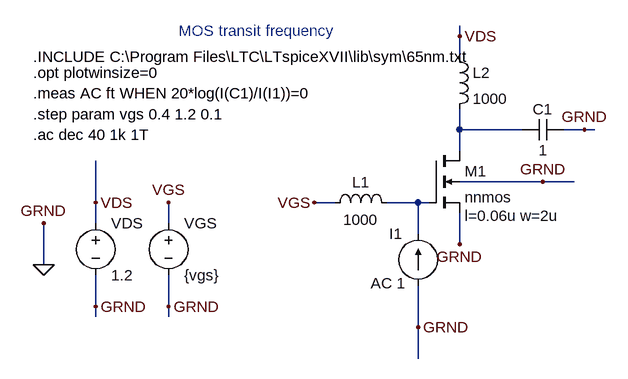
[diagram p0: schematic 4MOS transit frequency.asc]
4MOS transit frequency.asc, the LTspice schematic file:
Version 4
SHEET 1 880 680
WIRE 368 -32 368 -48
WIRE 368 0 368 -32
WIRE 368 112 368 80
WIRE 464 112 368 112
WIRE 560 112 528 112
WIRE 576 112 560 112
WIRE 368 144 368 112
WIRE 496 192 368 192
WIRE 544 192 496 192
WIRE -192 224 -192 160
WIRE 176 224 144 224
WIRE 304 224 256 224
WIRE 320 224 304 224
WIRE -192 256 -192 224
WIRE -80 256 -80 224
WIRE 304 272 304 224
WIRE 368 288 368 240
WIRE -272 320 -272 256
WIRE -192 384 -192 336
WIRE -80 384 -80 336
WIRE -192 400 -192 384
WIRE -80 400 -80 384
WIRE 304 416 304 352
WIRE 304 464 304 416
FLAG -272 320 0
FLAG -80 224 VGS
FLAG -192 224 VDS
FLAG -272 256 GRND
FLAG 368 288 GRND
FLAG -80 384 GRND
FLAG -192 384 GRND
FLAG 496 192 GRND
FLAG 560 112 GRND
FLAG 368 -32 VDS
FLAG 144 224 VGS
FLAG 304 416 GRND
SYMBOL nmos4 320 144 R0
WINDOW 123 56 100 Left 2
SYMATTR Value2 l=0.06u w=2u
SYMATTR InstName M1
SYMATTR Value nnmos
SYMBOL voltage -192 240 R0
SYMATTR InstName VDS
SYMATTR Value 1.2
SYMBOL voltage -80 240 R0
SYMATTR InstName VGS
SYMATTR Value {vgs}
SYMBOL ind 160 240 R270
WINDOW 0 32 56 VTop 2
WINDOW 3 5 56 VBottom 2
SYMATTR InstName L1
SYMATTR Value 1000
SYMBOL ind 352 -16 R0
SYMATTR InstName L2
SYMATTR Value 1000
SYMBOL cap 528 96 R90
WINDOW 0 0 32 VBottom 2
WINDOW 3 32 32 VTop 2
SYMATTR InstName C1
SYMATTR Value 1
SYMBOL current 304 352 R180
WINDOW 0 24 80 Left 2
WINDOW 3 24 0 Left 2
WINDOW 123 20 4 Left 2
WINDOW 39 0 0 Left 0
SYMATTR InstName I1
SYMATTR Value ""
SYMATTR Value2 AC 1
TEXT -288 0 Left 2 !.INCLUDE C:\\Program Files\\LTC\\LTspiceXVII\\lib\\sym\\65nm.txt
TEXT -288 24 Left 2 !.opt plotwinsize=0
TEXT -288 88 Left 2 !.step param vgs 0.4 1.2 0.1
TEXT -288 120 Left 2 !.ac dec 40 1k 1T
TEXT -288 56 Left 2 !.meas AC ft WHEN 20*log(I(C1)/I(I1))=0
TEXT -64 -40 Left 2 ;MOS transit frequency

The netlist it stands for:
* 4MOS transit frequency.asc
M1 N001 N002 0 0 nnmos l=0.06u w=2u
VDS VDS 0 1.2
VGS VGS 0 {vgs}
L1 VGS N002 1000
L2 VDS N001 1000
C1 0 N001 1
I1 0 N002 AC 1
.model NMOS NMOS
.model PMOS PMOS
.lib standard.mos
.INCLUDE C:\Program Files\LTC\LTspiceXVII\lib\sym\65nm.txt
.opt plotwinsize=0
.step param vgs 0.4 1.2 0.1
.ac dec 40 1k 1T
.meas AC ft WHEN 20*log(I(C1)/I(I1))=0
* MOS transit frequency
.backanno
.end